# Altium project Underwater_ROV_PDB_17.PrjPcb
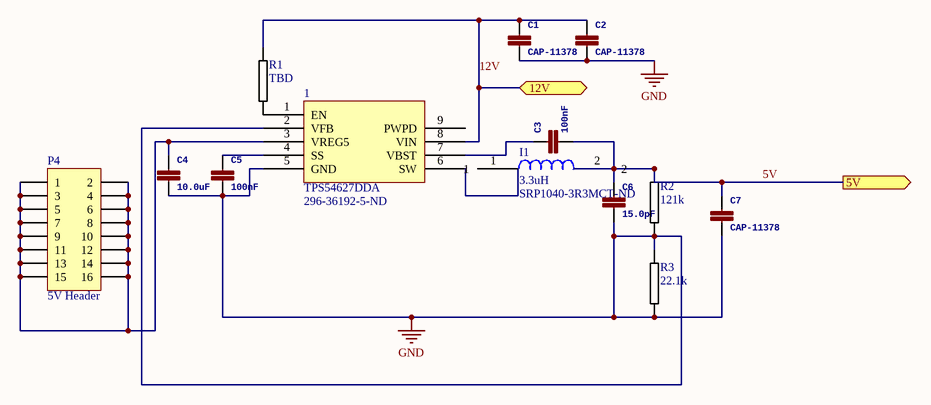
[diagram p0: 5V Regulator.SchDoc]
4 sheets, 41 parts. Net scope: global (net labels, ports and power ports of the same name join across sheets).
Board file: Underwater_ROV_PDB_17.PcbDoc
Sheets:
  5V Regulator.SchDoc
  3_3V Regulator.SchDoc
  12V Regulator.SchDoc
  Current sensing.SchDoc

## Sheet 5V Regulator.SchDoc
size A

### Parts
1  TPS54627DDA  Supplier Part Number 1: 296-36192-5-ND  [SOIC127P600X170_HS-9N]
C1  CAP-11378  [0603]
C2  CAP-11378  [0603]
C3  100nF  [0603]
C4  10.0uF  [0603]
C5  100nF  [0603]
C6  15.0pF  [0603]
C7  CAP-11378  [0603]
I1  3.3uH  Supplier Part Number 1: SRP1040-3R3MCT-ND  [SRP1040]
P4  5V Header  [HDR2X8H]
R1  TBD  [0402R-TBD]
R2  121k  [0402R-TBD]
R3  22.1k  [0402R-TBD]

### Ports
5V (out), 12V

### Nets
GND: 1.2(VFB) 1.5(GND) C1.2 C2.2 C4.2 C5.2 C6.2 C7.2 R2.2 R3.1 R3.2
5V: C3.2 C6.1 C7.1 I1.2 R2.1 ; port 5V
12V: 1.8(VIN) C1.1 C2.1 R1.1 ; port 12V
Net1_1: 1.1(EN) R1.2
Net1_3: 1.3(VREG5) C4.1 P4.1 P4.2 P4.3 P4.4 P4.5 P4.6 P4.7 P4.8 P4.9 P4.10 P4.11 P4.12 P4.13 P4.14 P4.15 P4.16
Net1_4: 1.4(SS) C5.1
Net1_6: 1.6(SW) I1.1
Net1_7: 1.7(VBST) C3.1

Not connected (* = marked no-connect by the designer): 1 9(PWPD)

### Library data of the parts
1 = TPS54627DDA: IC REG BUCK ADJ 6A SYNC 8SOPWR; Manufacturer: Texas Instruments; Function: Step-Down; Output Configuration: Positive; Output Type: Adjustable; Number of Outputs: 1; Voltage - Input (Min): 4.5V; Voltage - Input (Max): 18V; Voltage - Output (Min/Fixed): 0.765V; Voltage - Output (Max): 5.5V; Frequency - Switching: 650kHz; Synchronous Rectifier: Yes; Supplier 1: Digi-Key; Manufacturer Part Number: TPS54627DDA; RoHS: RoHS Compliant; Category: Integrated Circuits (ICs); Stock 1: 282; Pricing 1: 1=2.94, 10=2.639, 100=2.1626, 500=1.84094, 1000=1.5526 (USD); Packaging: Tube; Part Status: Active; Topology: Buck; Current - Output: 6A; Operating Temperature: -40°C ~ 85°C (TA); Mounting Type: Surface Mount; Package / Case: 8-PowerSOIC (0.154", 3.90mm Width); Supplier Device Package: 8-SO PowerPad; Base Part Number: TPS54627; ComponentLink1URL: http://www.ti.com/lit/ds/symlink/tps54627.pdf; ComponentLink1Description: http://www.ti.com/lit/ds/symlink/tps54627.pdf
C1 C2 C7 = 4.7NF-50V-10%(0603): PROD_ID: CAP-11378
C3-C6 = 4.7NF-50V-10%(0603): PROD_ID: CAP-11378
I1 = SRP1040-3R3M: FIXED IND 3.3UH 10A 10 MOHM SMD; Manufacturer: Bourns Inc.; Material - Core: Iron; Tolerance: ±20%; Shielding: Shielded; DC Resistance (DCR): 10 mOhm Max; Supplier 1: Digi-Key; Manufacturer Part Number: SRP1040-3R3M; RoHS: RoHS Compliant; Category: Inductors, Coils, Chokes; Stock 1: 575; Pricing 1: 1=1.43, 10=1.32, 100=0.9237 (USD); Packaging: Cut Tape (CT); Part Status: Active; Type: -; Q @ Freq: -; Ratings: -; Operating Temperature: -55°C ~ 150°C; Mounting Type: Surface Mount; Package / Case: Nonstandard; Supplier Device Package: -; Size / Dimension: 0.465" L x 0.413" W (11.80mm x 10.50mm); Height - Seated (Max): 0.165" (4.20mm); ComponentLink1URL: http://www.bourns.com/docs/Product-Datasheets/SRP1040.pdf; ComponentLink1Description: http://www.bourns.com/docs/Product-Datasheets/SRP1040.pdf
P4 = Header 8X2H: Header, 8-Pin, Dual row, Right Angle; LatestRevisionDate: 17-Jul-2002; LatestRevisionNote: Re-released for DXP Platform.; Publisher: Altium Limited
R1-R3 = 0402R-TBD: RESISTOR 0402 VALUE TO BE DETERMINED

## Sheet 3_3V Regulator.SchDoc
size A
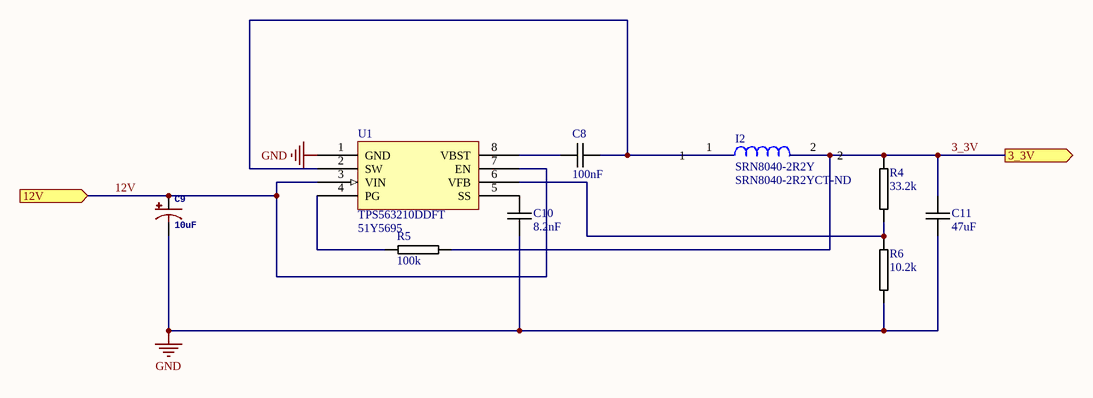
[diagram p1: 3_3V Regulator.SchDoc]

### Parts
C8  100nF  [0805C-TBD]
C9  10uF  [EIA3216]
C10  8.2nF  [0603C-GENERIC]
C11  47uF  [0805C-TBD]
I2  SRN8040-2R2Y  Supplier Part Number 1: SRN8040-2R2YCT-ND  [SRN8040]
R4  33.2k  [0402R-TBD]
R5  100k  [0402R-TBD]
R6  10.2k  [0402R-TBD]
U1  TPS563210DDFT  Supplier Part Number 1: 51Y5695  [SOT23-8]

### Ports
3_3V (out), 12V (in)

### Nets
GND: C9.C(-) C10.2 C11.1 R6.2 U1.1(GND)
3_3V: C11.2 I2.2 R4.1 R5.2 ; port 3_3V
12V: C9.A(+) U1.3(VIN) U1.7(EN) ; port 12V
NetC8_1: C8.1 U1.8(VBST)
NetC8_2: C8.2 I2.1 U1.2(SW)
NetC10_1: C10.1 U1.5(SS)
NetR4_2: R4.2 R6.1 U1.6(VFB)
NetR5_1: R5.1 U1.4(PG)

### Library data of the parts
C8 C11 = 0603C-2U2-6V3-X5R-PAN: CAPACITOR 0805 CERAMIC; Manufacturer Part Number: ECJ-1VB0J225K; Manufacturer: Panasonic - ECG; Supplier 1: Digi-Key; Supplier Part Number 1: PCC2273TR-ND; Reel: *
C9 = 10UF-TANT: PROD_ID: CAP-00811
C10 = 0603C-000: CAPACITOR 0603 CERAMIC
I2 = SRN8040-2R2Y: FIXED IND 2.2UH 6.3A 13 MOHM SMD; Manufacturer: Bourns Inc.; Material - Core: Ferrite; Tolerance: ±30%; Shielding: Semi-Shielded; DC Resistance (DCR): 13 mOhm Max; Q @ Freq: 13 @ 7.96MHz; Supplier 1: Digi-Key; Manufacturer Part Number: SRN8040-2R2Y; RoHS: RoHS Compliant; Category: Inductors, Coils, Chokes; Stock 1: 10441; Pricing 1: 1=0.63, 10=0.547, 100=0.391, 500=0.32844 (USD); Packaging: Cut Tape (CT); Part Status: Active; Type: Wirewound; Ratings: -; Operating Temperature: -40°C ~ 125°C; Mounting Type: Surface Mount; Package / Case: Nonstandard; Supplier Device Package: -; Size / Dimension: 0.315" L x 0.315" W (8.00mm x 8.00mm); Height - Seated (Max): 0.157" (4.00mm); ComponentLink1URL: http://www.bourns.com/docs/Product-Datasheets/SRN8040.pdf; ComponentLink1Description: http://www.bourns.com/docs/Product-Datasheets/SRN8040.pdf
R4-R6 = 0402R-TBD: RESISTOR 0402 VALUE TO BE DETERMINED
U1 = TPS563210DDFT: TEXAS INSTRUMENTS - TPS563210DDFT - DC/DC CONV, SYNC BUCK, 650KHZ, SOT-23-8; Topology: Synchronous Buck (Step Down); Input Voltage Min: 4.5; Input Voltage Max: 17; No. of Outputs: 1; DC / DC Converter IC Case: SOT-23; No. of Pins: 8; Output Current: 3; Supplier 1: Newark; Manufacturer: TEXAS INSTRUMENTS; Manufacturer Part Number: TPS563210DDFT; RoHS: YES; Stock 1: 60; Pricing 1: 1=1.92, 10=1.63, 25=1.52, 50=1.41, 100=1.3 (USD); ComponentLink1URL: http://www.ti.com/general/docs/lit/getliterature.tsp?genericPartNumber=TPS563210&amp;&amp;fileType=pdf; ComponentLink1Description: http://www.ti.com/general/docs/lit/getliterature.tsp?genericPartNumber=TPS563210&amp;&amp;fileType=pdf

## Sheet 12V Regulator.SchDoc
size A
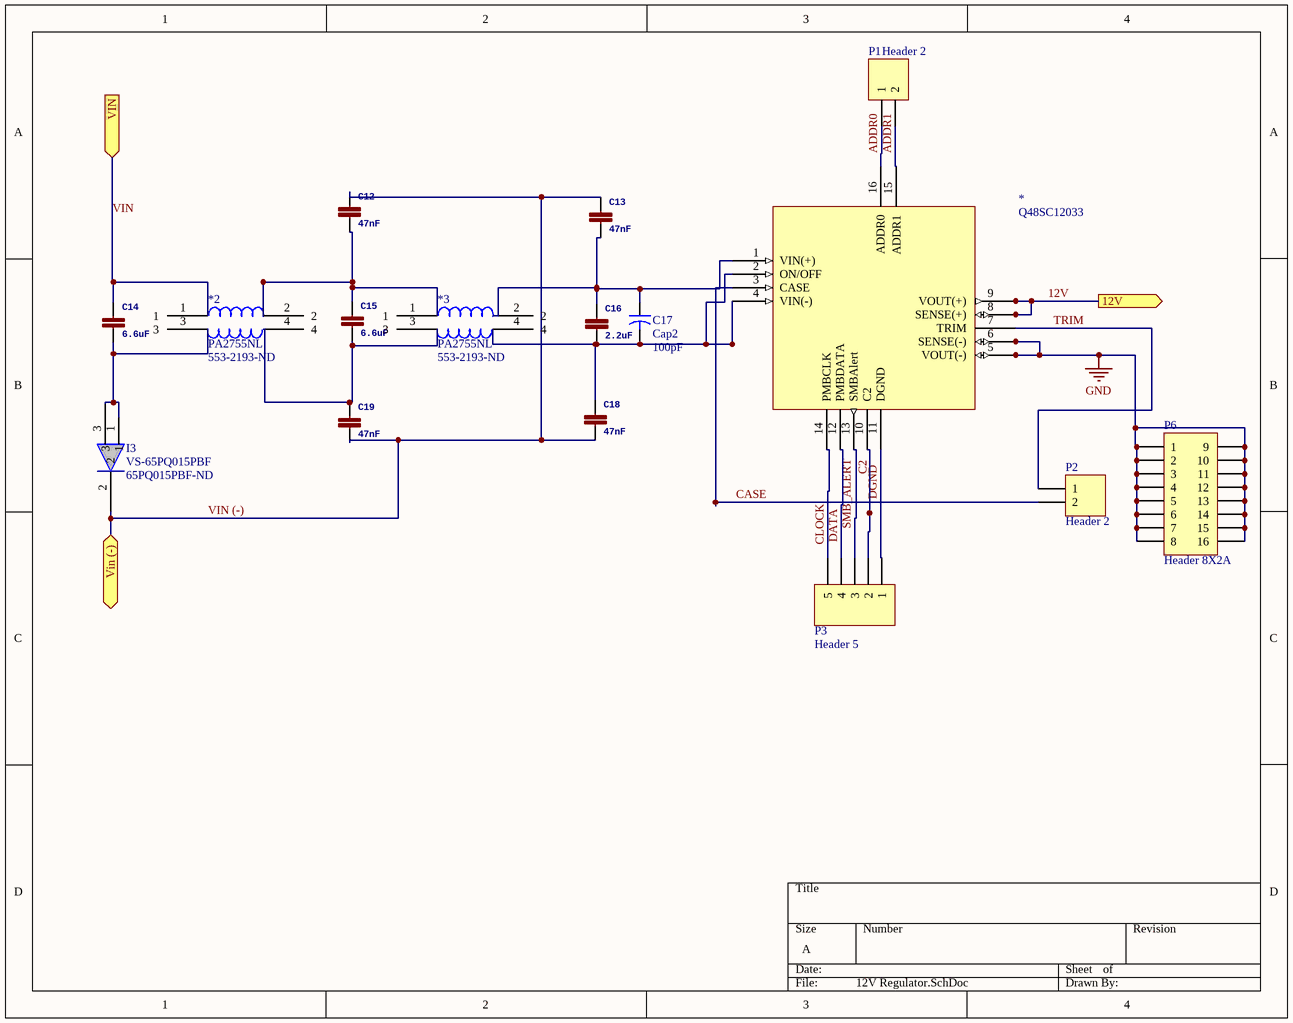
[diagram p2: 12V Regulator.SchDoc]

### Parts
*  Q48SC12033  [PCBComponent_1]
*2  PA2755NL  Supplier Part Number 1: 553-2193-ND  [Makeni]
*3  PA2755NL  Supplier Part Number 1: 553-2193-ND  [Makeni]
C12  47nF  [0402-CAP]
C13  47nF  [0402-CAP]
C14  6.6uF  [1206]
C15  6.6uF  [1206]
C16  2.2uF  [0603]
C17  Cap2  value 100pF  [CAPR5-4X5]
C18  47nF  [0402-CAP]
C19  47nF  [0402-CAP]
I3  VS-65PQ015PBF  Supplier Part Number 1: 65PQ015PBF-ND  [TO247AC]
P1  Header 2  [HDR1X2]
P2  Header 2  [HDR1X2]
P3  Header 5  [HDR1X5]
P6  Header 8X2A  [HDR2X8_CEN]

### Ports
12V (out), Vin (-), VIN (in)

### Nets
GND: *.5(VOUT(-)) *.6(SENSE(-)) P6.1 P6.2 P6.3 P6.4 P6.5 P6.6 P6.7 P6.8 P6.9 P6.10 P6.11 P6.12 P6.13 P6.14 P6.15 P6.16
12V: *.8(SENSE(+)) *.9(VOUT(+)) ; port 12V
ADDR0: *.16(ADDR0) P1.1
ADDR1: *.15(ADDR1) P1.2
CASE: *.3(CASE) P2.2
CLOCK: *.14(PMBCLK) P3.5
DATA: *.12(PMBDATA) P3.4
DGND: *.11(DGND) P3.1
SMB_ALERT: *.13(SMBAlert) P3.3
TRIM: *.7(TRIM) P2.1
VIN: *2.1 C14.1 ; port VIN
VIN (-): C12.1 C13.1 C18.2 C19.2 I3.2 ; port Vin (-)
Net*2_2: *2.2 *3.1 C12.2 C15.1
Net*2_3: *2.3 C14.2 I3.1 I3.3
Net*2_4: *2.4 *3.3 C15.2 C19.1
Net*_1: *.1(VIN(+)) *3.2 C13.2 C16.1 C17.1
Net*_2: *.2(ON/OFF) *.4(VIN(-)) *3.4 C16.2 C17.2 C18.1
Net*_10: *.10(C2) P3.2

### Notes on the sheet
- Labels drawn without touching a wire or pin: C2

### Library data of the parts
*2 *3 = PA2755NL: COMMON MODE CHOKE 14A 2LN SMD; Manufacturer: Pulse Electronics Power; Number of Lines: 2; DC Resistance (DCR) (Max): 1.95 mOhm; Supplier 1: Digi-Key; Manufacturer Part Number: PA2755NL; RoHS: RoHS Compliant; Category: Filters; Stock 1: 1352; Pricing 1: 1=3.45, 10=3.163, 100=2.07, 500=1.84, 1000=1.725, 2500=1.6675 (USD); Packaging: Tube; Part Status: Active; Filter Type: -; Current Rating (Max): 14A; Voltage Rating - DC: -; Voltage Rating - AC: -; Operating Temperature: -40°C ~ 130°C; Ratings: -; Approvals: -; Features: -; Mounting Type: Surface Mount; Size / Dimension: 0.750" L x 0.815" W (19.05mm x 20.70mm); Height (Max): 0.440" (11.18mm); Package / Case: Horizontal, 4 PC Pad; ComponentLink1URL: http://productfinder.pulseeng.com/products/datasheets/P688.pdf; ComponentLink1Description: http://productfinder.pulseeng.com/products/datasheets/P688.pdf
C12 C13 C18 C19 = 2.2UF-CERCAP-07888: PROD_ID: CAP-07888
C14 C15 = 2.2UF-CERCAP-10009: PROD_ID: CAP-10009
C16 = 1.5PF-0603-50V-16.667%: PROD_ID: CAP-08763
C17 = Cap2: Capacitor; Published: 23-Sep-2002; PackageReference: CAPR5-4X5; Publisher: Altium Limited; PackageDescription: Capacitor; 2 Leads
I3 = VS-65PQ015PBF: DIODE SCHOTTKY 15V 65A TO247AC; Manufacturer: Vishay Semiconductor Diodes Division; Speed: Fast Recovery =< 500ns, > 200mA (Io); Supplier 1: Digi-Key; Manufacturer Part Number: VS-65PQ015PBF; RoHS: RoHS Compliant; Category: Discrete Semiconductor Products; Stock 1: 478; Pricing 1: 1=4.17, 10=3.749, 25=3.5436, 100=3.0713, 250=2.91376, 500=2.6145, 1000=2.205 (USD); Packaging: Tube; Part Status: Active; Diode Type: Schottky; Current - Average Rectified (Io): 65A; Capacitance @ Vr, F: -; Mounting Type: Through Hole; Package / Case: TO-247-3; Supplier Device Package: TO-247AC; Operating Temperature - Junction: -55°C ~ 125°C; Base Part Number: *; ComponentLink1URL: http://www.vishay.com/docs/94246/vs-65pq015p.pdf; ComponentLink1Description: http://www.vishay.com/docs/94246/vs-65pq015p.pdf
P1 P2 = Header 2: Header, 2-Pin; LatestRevisionDate: 17-Jul-2002; LatestRevisionNote: Re-released for DXP Platform.; Publisher: Altium Limited
P3 = Header 5: Header, 5-Pin; LatestRevisionDate: 17-Jul-2002; LatestRevisionNote: Re-released for DXP Platform.; Publisher: Altium Limited
P6 = Header 8X2A: Header, 8-Pin, Dual row; LatestRevisionDate: 17-Jul-2002; LatestRevisionNote: Re-released for DXP Platform.; Publisher: Altium Limited

## Sheet Current sensing.SchDoc
size A
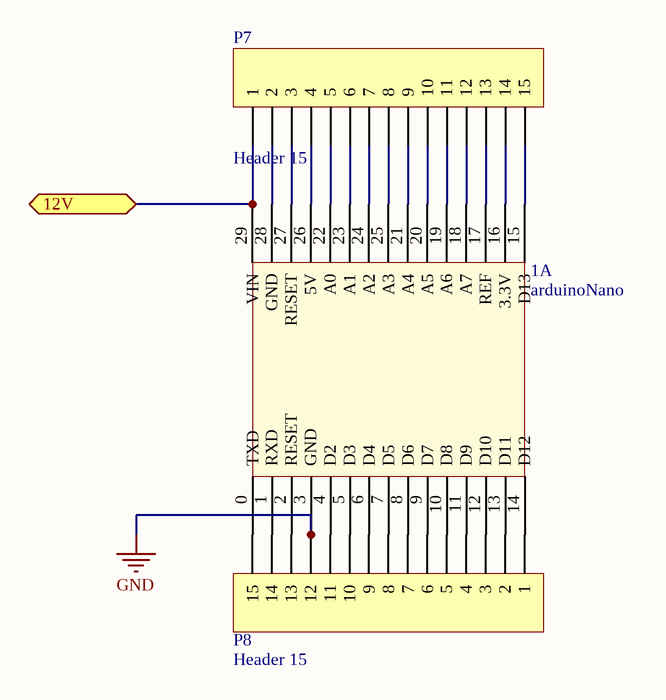
[diagram p3: Current sensing.SchDoc]

### Parts
1A  arduinoNano  [Arduino nano]
P7  Header 15  [HDR1X15]
P8  Header 15  [HDR1X15]

### Ports
12V

### Nets
GND: 1A.3(GND) P8.12
12V: 1A.29(VIN) P7.1 ; port 12V
Net1A_0: 1A.0(TXD) P8.15
Net1A_1: 1A.1(RXD) P8.14
Net1A_2: 1A.2(RESET) P8.13
Net1A_4: 1A.4(D2) P8.11
Net1A_5: 1A.5(D3) P8.10
Net1A_6: 1A.6(D4) P8.9
Net1A_7: 1A.7(D5) P8.8
Net1A_8: 1A.8(D6) P8.7
Net1A_9: 1A.9(D7) P8.6
Net1A_10: 1A.10(D8) P8.5
Net1A_11: 1A.11(D9) P8.4
Net1A_12: 1A.12(D10) P8.3
Net1A_13: 1A.13(D11) P8.2
Net1A_14: 1A.14(D12) P8.1
Net1A_15: 1A.15(D13) P7.15
Net1A_16: 1A.16(3.3V) P7.14
Net1A_17: 1A.17(REF) P7.13
Net1A_18: 1A.18(A7) P7.12
Net1A_19: 1A.19(A6) P7.11
Net1A_20: 1A.20(A5) P7.10
Net1A_21: 1A.21(A4) P7.9
Net1A_22: 1A.22(A0) P7.5
Net1A_23: 1A.23(A1) P7.6
Net1A_24: 1A.24(A2) P7.7
Net1A_25: 1A.25(A3) P7.8
Net1A_26: 1A.26(5V) P7.4
Net1A_27: 1A.27(RESET) P7.3
Net1A_28: 1A.28(GND) P7.2

### Library data of the parts
P7 P8 = Header 15: Header, 15-Pin; LatestRevisionDate: 17-Jul-2002; LatestRevisionNote: Re-released for DXP Platform.; Publisher: Altium Limited

## Nets that join several sheets
GND: 5V Regulator (11 pins), 3_3V Regulator (5 pins), 12V Regulator (18 pins), Current sensing (1A.3 P8.12)
12V: 5V Regulator (1.8 C1.1 C2.1 R1.1), 3_3V Regulator (C9.A U1.3 U1.7), 12V Regulator (*.8 *.9), Current sensing (1A.29 P7.1)